# EAGLE design sonar (EAGLE 4.16)
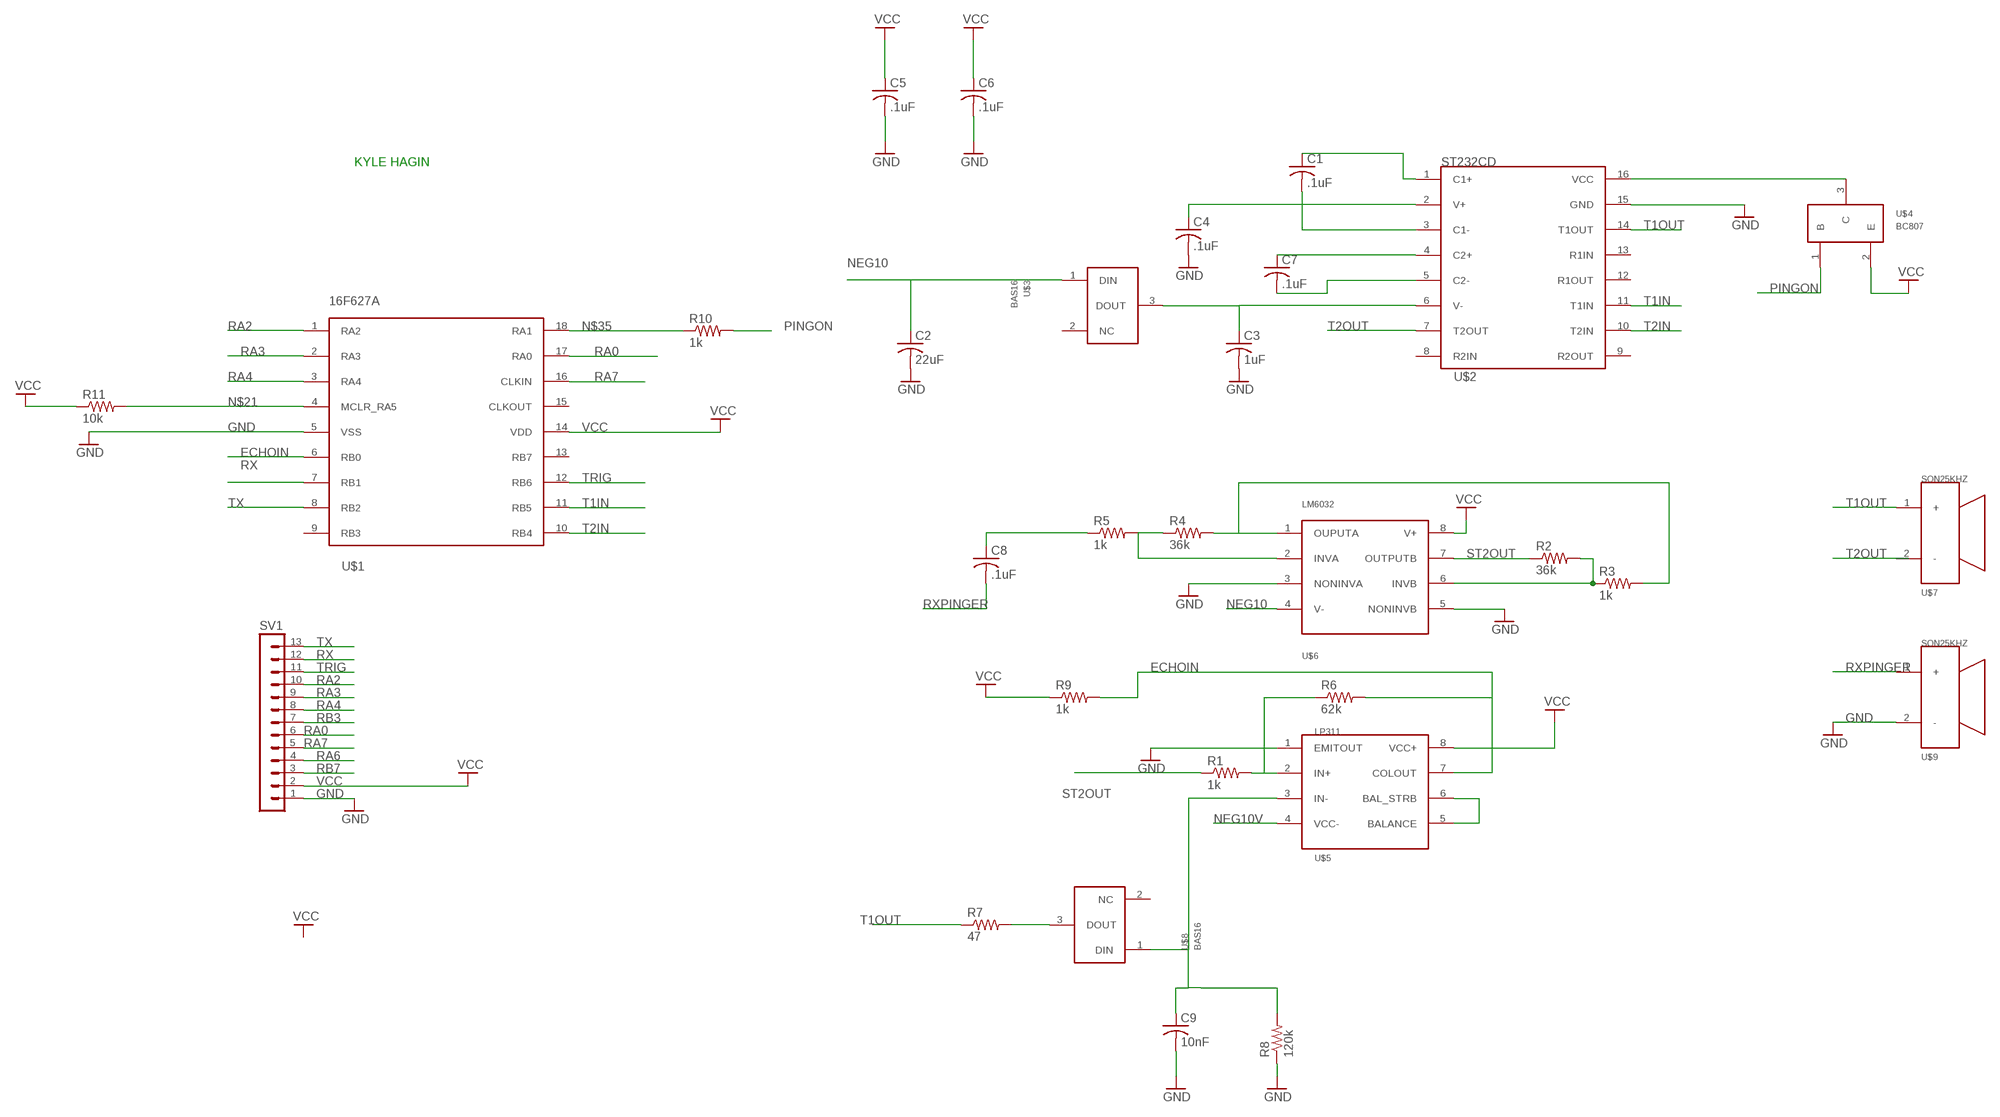
[diagram p0: schematic, sheet 1]

## Parts
C1  .1uF  C-USC1206  [C1206]
C2  22uF  C-USC1206  [C1206]
C3  1uF  C-USC1206  [C1206]
C4  .1uF  C-USC1206  [C1206]
C5  .1uF  C-USC1206  [C1206]
C6  .1uF  C-USC1206  [C1206]
C7  .1uF  C-USC1206  [C1206]
C8  .1uF  C-USC1206  [C1206]
C9  10nF  C-USC1206  [C1206]
R1  1k  R-US_R1206  [R1206]
R2  36k  R-US_R1206  [R1206]
R3  1k  R-US_R1206  [R1206]
R4  36k  R-US_R1206  [R1206]
R5  1k  R-US_R1206  [R1206]
R6  62k  R-US_R1206  [R1206]
R7  47  R-US_R1206  [R1206]
R8  120k  R-US_R1206  [R1206]
R9  1k  R-US_R1206  [R1206]
R10  1k  R-US_R1206  [R1206]
R11  10k  R-US_R1206  [R1206]
SV1  MA13-1W  [MA13-1W]
U$1  16F627A  [DIL18]
U$2  ST232CD  [SOIC-16]
U$3  BAS16  [SOT23]
U$4  BC807  [SOT23]
U$5  LP311  [SOIC8]
U$6  LM6032  [SOIC8]
U$7  SON25KHZ  [MPB1]
U$8  BAS16  [SOT23]
U$9  SON25KHZ  [MPB1]

## Nets
ECHOIN: R6.2 R9.2 U$1.6(RB0) U$5.7(COLOUT)
GND: C2.2 C3.2 C4.2 C5.2 C6.2 C9.2 R8.1 SV1.1 U$1.5(VSS) U$2.15(GND) U$5.1(EMITOUT) U$6.3(NONINVA) U$6.5(NONINVB) U$9.2(-)
N$1: C1.1 U$2.1(C1+)
N$2: C1.2 U$2.3(C1-)
N$3: C4.1 U$2.2(V+)
N$4: C7.1 U$2.4(C2+)
N$5: C7.2 U$2.5(C2-)
N$6: C3.1 U$2.6(V-) U$3.3(DOUT)
N$8: R3.2 R4.2 U$6.1(OUPUTA)
N$9: U$2.16(VCC) U$4.3(C)
N$10: R4.1 R5.2 U$6.2(INVA)
N$11: U$5.5(BALANCE) U$5.6(BAL_STRB)
N$12: R2.2 R3.1 U$6.6(INVB)
N$13: C8.1 R5.1
N$16: R1.2 R6.1 U$5.2(IN+)
N$17: R7.2 U$8.3(DOUT)
N$18: C9.1 R8.2 U$5.3(IN-) U$8.1(DIN)
N$21: R11.2 U$1.4(MCLR_RA5)
N$35: R10.1 U$1.18(RA1)
NEG10: C2.1 U$3.1(DIN) U$6.4(V-)
NEG10V: U$5.4(VCC-)
PINGON: R10.2 U$4.1(B)
RA0: SV1.6 U$1.17(RA0)
RA2: SV1.10 U$1.1(RA2)
RA3: SV1.9 U$1.2(RA3)
RA4: SV1.8 U$1.3(RA4)
RA6: SV1.4
RA7: SV1.5 U$1.16(CLKIN)
RB3: SV1.7
RB7: SV1.3
RX: SV1.12 U$1.7(RB1)
RXPINGER: C8.2 U$9.1(+)
ST2OUT: R1.1 R2.1 U$6.7(OUTPUTB)
T1IN: U$1.11(RB5) U$2.11(T1IN)
T1OUT: R7.1 U$2.14(T1OUT) U$7.1(+)
T2IN: U$1.10(RB4) U$2.10(T2IN)
T2OUT: U$2.7(T2OUT)
TRIG: SV1.11 U$1.12(RB6)
TX: SV1.13 U$1.8(RB2)
VCC: C5.1 C6.1 R9.1 R11.1 SV1.2 U$1.14(VDD) U$4.2(E) U$5.8(VCC+) U$6.8(V+)
Unconnected: U$1.9(RB3) U$1.13(RB7) U$1.15(CLKOUT) U$2.8(R2IN) U$2.9(R2OUT) U$2.12(R1OUT) U$2.13(R1IN) U$3.2(NC) U$7.2(-) U$8.2(NC)

## Notes on the sheet
- KYLE HAGIN

## Library data of the parts
C1-C9 = rcl:C-US: CAPACITOR, American symbol
R1-R11 = rcl:R-US_: RESISTOR, American symbol
SV1 = con-lstb:MA13-1W: PIN HEADER
U$1 = microchip:16F627A
U$2 = TXCVR:ST232CD
U$3 U$8 = TXCVR:BAS16
U$4 = TXCVR:BC807
U$5 = TXCVR:LP311
U$6 = TXCVR:LM6032
U$7 U$9 = con-hirschmann:SON25KHZ

## Board
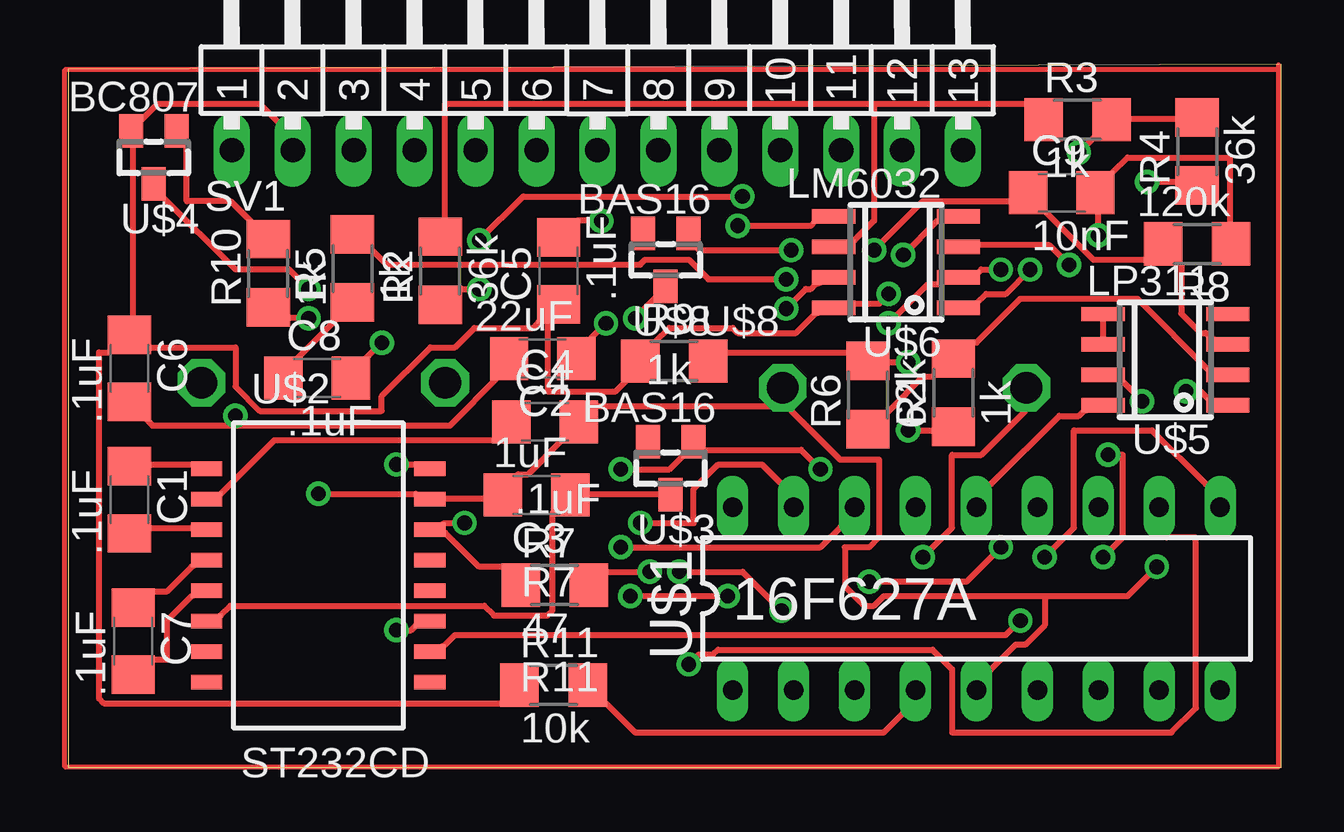
[diagram p1: board, top side]
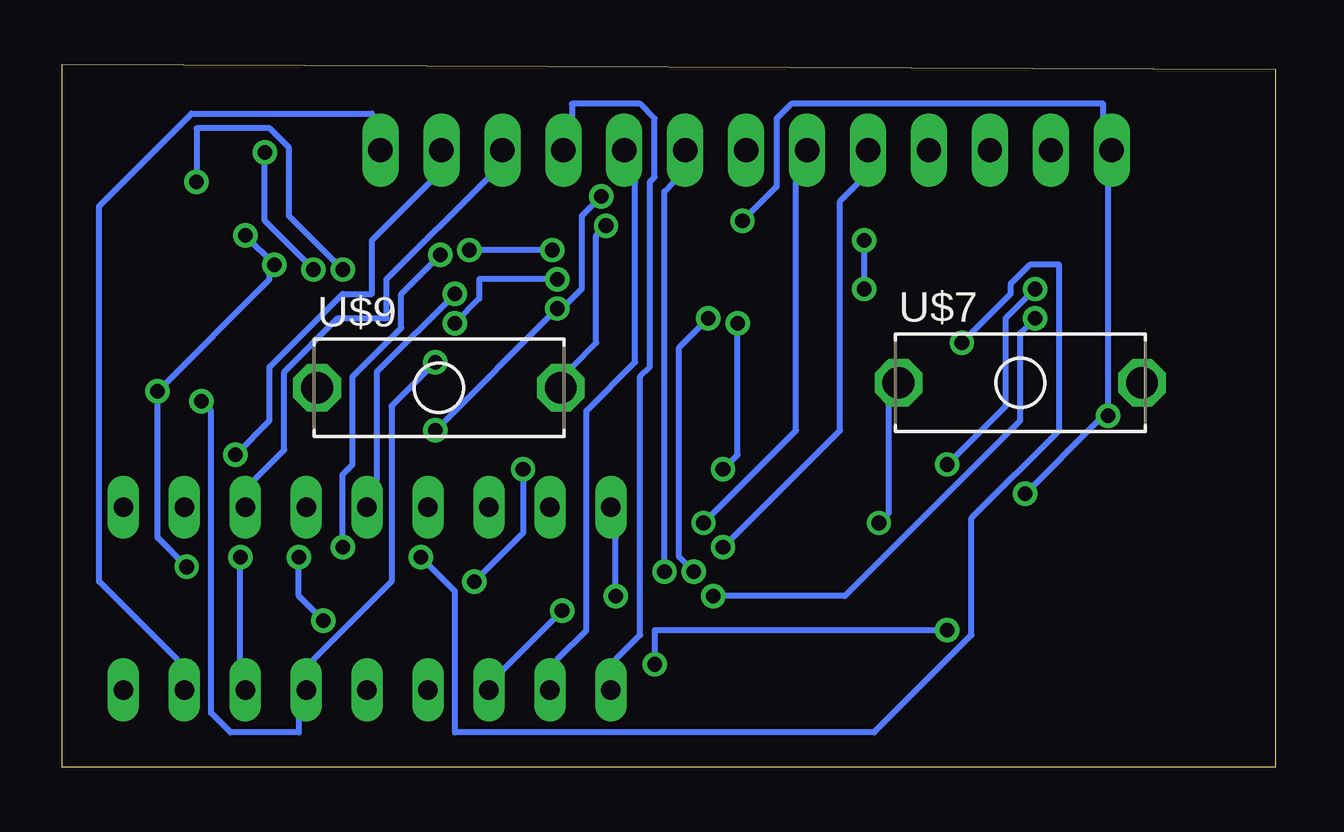
[diagram p2: board, bottom side, seen from below]

Size 50.57 x 29.3 mm. Coordinates in mm from the lower left corner, seen from the top.
Outline: 0,0 50.57,0 50.57,29.3 0,29.1 0,0
Copper layers (1*16): Top 0.035mm / dielectric 1.5mm / Bottom 0.035mm
Design rules "default": minimum track width 10mil, minimum drill 24mil, track to track 8mil, track to pad 8mil, pad to pad 8mil, via to via 8mil, smd to smd 8mil, copper to edge 40mil, drill to drill 8mil, minimum pad ring 10mil, minimum via ring 8mil, stop-mask expansion 4mil, vias tented up to drill 0mil, thermal gap 10mil

### Footprints (pad centres in the part's own frame; a part is rotated, then mirrored left to right if it is on the bottom)
C1206 = smd 1.6 x 1.8: 1 -1.4,0; 2 1.4,0
R1206 = smd 1.6 x 1.803: 1 -1.422,0; 2 1.422,0
MA13-1W = drill 1.016 long: 1 -15.24,0; 2 -12.7,0; 3 -10.16,0; 4 -7.62,0; 5 -5.08,0; 6 -2.54,0; 7 0,0; 8 2.54,0; 9 5.08,0; 10 7.62,0; 11 10.16,0; 12 12.7,0; 13 15.24,0
DIL18 = drill 0.813 long: 1 -10.16,-3.81; 2 -7.62,-3.81; 3 -5.08,-3.81; 4 -2.54,-3.81; 5 0,-3.81; 6 2.54,-3.81; 7 5.08,-3.81; 8 7.62,-3.81; 9 10.16,-3.81; 10 10.16,3.81; 11 7.62,3.81; 12 5.08,3.81; 13 2.54,3.81; 14 0,3.81; 15 -2.54,3.81; 16 -5.08,3.81; 17 -7.62,3.81; 18 -10.16,3.81
SOIC-16 = smd 0.6 x 1.3: 1 -4.445,-4.65; 2 -3.175,-4.65; 3 -1.905,-4.65; 4 -0.635,-4.65; 5 0.635,-4.65; 6 1.905,-4.65; 7 3.175,-4.65; 8 4.445,-4.65; 9 4.445,4.65; 10 3.175,4.65; 11 1.905,4.65; 12 0.635,4.65; 13 -0.635,4.65; 14 -1.905,4.65; 15 -3.175,4.65; 16 -4.445,4.65
SOT23 = smd 1 x 1.4: 1 -0.95,-1.1; 2 0.95,-1.1; 3 0,1.1
SOIC8 = smd 0.6 x 1.8: 1 -1.905,-2.6; 2 -0.635,-2.6; 3 0.635,-2.6; 4 1.905,-2.6; 5 1.905,2.6; 6 0.635,2.6; 7 -0.635,2.6; 8 -1.905,2.6
MPB1 = drill 1.321 octagon: 1 -5.08,0; 2 5.08,0

### Placement (x,y rotation side)
C1  2.55,11.15 270 top
C2  19.77,17.04 180 top
C3  19.52,11.35 180 top
C4  19.88,14.4 0 top
C5  20.43,20.7 90 top
C6  2.55,16.63 270 top
C7  2.71,5.25 270 top
C8  10.38,16.23 0 top
C9  41.41,23.95 0 top
R1  36.89,15.62 90 top
R2  15.51,20.7 90 top
R3  42.08,27 0 top
R4  47.05,25.67 90 top
R5  11.85,20.8 90 top
R6  33.34,15.51 90 top
R7  20.28,7.59 0 top
R8  47.05,21.81 180 top
R9  25.26,16.94 0 top
R10  8.34,20.59 90 top
R11  20.23,3.42 0 top
SV1  22.06,25.73 0 top
U$1  37.86,7.03 0 top
U$2  10.43,8 270 top
U$3  25.11,12.47 180 top
U$4  3.57,25.42 180 top
U$5  45.73,16.99 90 top
U$6  34.51,21.05 90 top
U$7  10.63,16.02 0 bottom
U$8  24.9,21.15 180 top
U$9  34.86,15.82 0 bottom

### Tracks (layer width: path | path; a pad name or v marks a point on that pad's centre or on a via)
ECHOIN  (via drill 0.61)
  Top 0.254: R9.2 27.29,17.29 32.58,17.29 R6.2 34.2,16.89 v35.01,16.89 | v44.77,15.26 43.96,16.07 U$5.7
  Bottom 0.254: v44.77,15.26 44.36,14.85 44.36,2.26 43.55,1.44 40.7,1.44 40.7,2.05 U$1.6 40.09,4.49 36.84,7.74 36.84,15.06 v35.01,16.89
GND  (via drill 0.61)
  Top 0.254: 6.97,14.24 15.91,14.24 17.95,16.28 C2.2 | 6.97,14.24 3.52,14.24 3.32,14.45 C6.2 | v22.21,22.78 21.2,22.78 C5.2 | 6.97,14.24 v6.97,14.65 | v41.72,20.95 40.91,21.76 37.86,21.76 U$6.3 | v42.94,22.17 42.94,23.19 C9.2 43.55,24.81 44.16,25.42 48.43,25.42 48.43,22.58 R8.1 | v46.6,15.67 47.21,15.67 47.61,15.26 U$5.1 | v27.9,22.58 30.95,22.58 31.15,22.78 U$6.5 | 40.7,7.13 40.7,5.91 39.89,5.1 39.48,5.1 38.47,4.08 U$1.5 | 40.7,7.13 34,7.13 33.59,6.73 33.19,6.73 32.37,7.54 32.37,9.16 33.39,9.16 33.8,9.57 33.8,12.82 32.17,12.82 30.14,14.85 U$9.2 29.32,15.06 22.01,15.06 C4.2 20.59,13.63 19.16,12.21 18.76,12.21 C3.2 17.34,11.2 15.71,11.2 U$2.15 14.49,11.4 v10.43,11.4 | v45.38,8.35 44.16,7.13 40.7,7.13
  Bottom 0.254: v22.21,22.78 20.79,24.2 20.79,27.05 20.18,27.66 7.18,27.66 7.18,27.05 SV1.1 6.97,24.4 v6.97,14.65 7.38,14.45 v10.43,11.4 | v42.94,22.17 v41.72,20.95 41.92,20.54 41.92,20.34 v46.6,15.67 46.6,9.57 v45.38,8.35 | v27.9,22.58 28.31,22.17 28.31,17.7 29.32,16.68 U$9.2
N$1
  Top 0.254: U$2.1 5.14,12.62 3.32,12.62 C1.1
N$2
  Top 0.254: U$2.3 5.14,9.98 3.32,9.98 C1.2
N$3
  Top 0.254: U$2.2 6.36,11.4 8.6,13.63 17.74,13.63 C4.1
N$4
  Top 0.254: U$2.4 5.14,8.35 4.13,7.34 3.52,7.34 C7.1
N$5
  Top 0.254: U$2.5 5.14,7.13 4.13,6.12 4.13,4.49 3.52,4.49 C7.2
N$6
  Top 0.254: U$2.6 6.36,6.32 6.77,6.73 17.34,6.73 17.74,6.32 19.98,6.32 20.18,6.52 20.18,10.59 C3.1 21.6,11.4 24.65,11.4 U$3.3
N$7
  Top 0.203: 50.46,29.08 50.46,0.02 -0.14,0.02 -0.14,29.08 50.46,29.08 | 50.46,29.08 50.46,29.28
N$8  (via drill 0.61)
  Top 0.254: v40.09,20.75 39.08,19.73 38.27,19.73 37.86,19.32 U$6.1 | v42.13,25.62 42.74,26.23 R3.2 44.16,27.05 46.19,27.05 R4.2
  Bottom 0.254: v40.09,20.75 42.13,22.78 v42.13,25.62
N$9  (via drill 0.61)
  Top 0.254: v13.68,12.62 14.49,12.62 U$2.16 | v10.02,19.93 9.21,20.75 6.97,20.75 3.92,23.79 U$4.3
  Bottom 0.254: v13.68,12.62 11.24,15.06 11.24,18.71 v10.02,19.93
N$10  (via drill 0.61)
  Top 0.254: v38.88,20.75 38.06,20.75 37.86,20.54 U$6.2 36.23,20.14 35.83,20.14 v34.2,18.51 | v44.97,24.4 46.19,24.4 R4.1 | v29.93,20.34 26.68,20.34 25.87,21.15 24.04,21.15 23.84,20.95 13.27,20.95 12.66,21.56 R5.2
  Bottom 0.254: v38.88,20.75 41.11,22.98 41.11,25.83 41.92,26.64 44.97,26.64 v44.97,24.4 | v29.93,20.34 33.19,20.34 33.19,19.53 v34.2,18.51
N$11
  Top 0.254: U$5.6 43.14,17.9 43.14,18.71 U$5.5
N$12
  Top 0.254: 33.59,27.66 33.59,22.78 32.78,21.97 U$6.6 | 33.59,27.66 39.89,27.66 R3.1 | 33.59,27.66 15.71,27.66 15.71,22.78 R2.2
N$13
  Top 0.254: C8.1 9.61,17.09 11.24,18.71 R5.1
N$16
  Top 0.254: U$5.2 47.61,16.48 44.56,19.53 39.69,19.53 37.86,17.7 37.66,17.7 R1.2 36.03,16.28 35.62,16.28 34.2,14.85 R6.1
N$17  (via drill 0.61)
  Top 0.254: v23.64,18.71 24.45,19.53 U$8.3 | v24.24,8.15 22.42,8.15 R7.2
  Bottom 0.254: v23.64,18.71 24.85,17.5 24.85,8.76 v24.24,8.15
N$18  (via drill 0.61)
  Top 0.254: U$5.3 47.61,17.9 47.41,18.11 47.21,18.11 46.39,18.92 46.39,20.95 R8.2 44.97,21.15 42.74,21.15 40.7,23.19 C9.1 39.28,23.59 35.62,23.59 v33.59,21.56 | v30.14,21.56 26.28,21.56 U$8.1
  Bottom 0.254: v30.14,21.56 v33.59,21.56
N$21
  Top 0.254: R11.2 22.42,2.66 23.64,1.44 34,1.44 34.81,2.26 U$1.4
N$35  (via drill 0.61)
  Top 0.254: v10.02,18.71 9.21,18.71 R10.1 | v23.43,7.13 v27.5,7.13
  Bottom 0.254: v10.02,18.71 10.63,18.11 10.63,14.45 17.95,7.13 v23.43,7.13 | v27.5,7.13 27.5,9.57 U$1.18
NEG10  (via drill 0.61)
  Top 0.254: v23.03,12.42 25.06,12.42 25.67,13.03 U$3.1 26.48,13.23 30.54,13.23 v31.36,12.42 | v22.42,18.51 21.81,17.9 C2.1 | v34.81,21.36 36.23,22.78 U$6.4 | v38.88,9.16 37.45,7.74 v33.39,7.74
  Bottom 0.254: v23.03,12.42 22.42,13.03 v22.42,18.51 | v34.81,21.36 36.44,19.73 36.44,18.31 38.47,16.28 38.47,12.62 38.88,12.21 v38.88,9.16 | v33.39,7.74 31.36,9.77 v31.36,12.42
PINGON
  Top 0.254: U$4.1 4.94,25.83 4.94,23.59 6.77,23.59 7.58,22.78 R10.2
RA0  (via drill 0.61)
  Top 0.254: v23.84,10.18 26.07,10.18 26.07,11.6 27.09,12.62 28.92,12.62 29.73,11.81 U$1.17
  Bottom 0.254: v23.84,10.18 19.98,14.04 19.98,24.4 SV1.6
RA2
  Bottom 0.254: U$1.1 27.5,4.49 26.48,5.51 26.48,16.28 26.07,16.68 26.07,24.4 25.87,24.61 25.87,27.05 26.48,27.66 29.32,27.66 29.32,27.05 SV1.10
RA3
  Bottom 0.254: U$1.2 29.93,4.49 28.72,5.71 28.72,14.85 26.68,16.89 26.68,24.4 SV1.9
RA4  (via drill 0.61)
  Top 0.254: v29.73,6.52 28.11,8.15 v25.46,8.15
  Bottom 0.254: v29.73,6.52 32.17,4.08 U$1.3 | v25.46,8.15 25.46,24 25.06,24.4 SV1.8
RA7  (via drill 0.61)
  Top 0.254: v23.03,9.16 31.36,9.16 32.17,9.98 U$1.16
  Bottom 0.254: v23.03,9.16 18.15,14.04 18.15,23.59 17.34,24.4 SV1.5
RX  (via drill 0.61)
  Top 0.254: v43.14,8.76 43.96,9.57 43.96,13.03 v43.35,13.03
  Bottom 0.254: v43.14,8.76 43.14,4.49 U$1.7 | v43.35,13.03 41.92,14.45 41.92,16.68 38.88,19.73 37.66,19.73 37.66,21.97 35.22,24.4 SV1.12
RXPINGER  (via drill 0.61)
  Top 0.254: v13.07,17.7 12.46,17.09 C8.2 | v35.62,8.76 36.84,9.98 36.84,13.03 38.06,13.03 39.89,14.85 U$9.1
  Bottom 0.254: v13.07,17.7 11.04,19.73 11.04,20.14 10.22,20.95 9,20.95 9,14.04 12.66,10.38 12.66,5.51 16.73,1.44 34.2,1.44 34.2,7.34 v35.62,8.76
ST2OUT  (via drill 0.61)
  Top 0.254: v29.93,19.12 30.75,19.93 30.95,19.93 31.15,20.14 U$6.7 | v35.01,14.04 36.03,14.04 R1.1 | v17.13,19.93 16.32,19.93 R2.1 | v17.13,21.97 18.96,23.79 v28.11,23.79
  Bottom 0.254: v35.01,14.04 v29.93,19.12 29.53,19.32 28.92,19.93 28.92,22.98 v28.11,23.79 | v17.13,19.93 v17.13,21.97
T1IN  (via drill 0.61)
  Top 0.254: v13.68,5.71 14.29,5.71 14.49,5.91 U$2.11 | v25.87,4.29 26.28,4.69 26.89,4.69 27.09,4.9 36.03,4.9 36.84,4.08 36.84,1.44 45.99,1.44 47,2.46 47,9.57 45.78,9.57 U$1.11
  Bottom 0.254: v13.68,5.71 25.87,5.71 v25.87,4.29
T1OUT  (via drill 0.61)
  Top 0.254: R7.1 18.15,8.35 17.13,8.35 15.71,9.77 U$2.14 15.71,10.18 v16.52,10.18
  Bottom 0.254: v16.52,10.18 16.12,10.59 16.12,15.06 U$7.1
T2IN  (via drill 0.61)
  Top 0.254: v39.69,6.12 39.08,5.51 16.12,5.51 15.71,5.1 U$2.10 | v40.7,8.76 41.92,9.98 41.92,14.04 45.17,14.04 47.41,11.81 U$1.10
  Bottom 0.254: v39.69,6.12 40.7,7.13 v40.7,8.76
TRIG
  Bottom 0.254: U$1.12 42.53,12.01 41.31,13.23 41.31,16.48 39.08,18.71 37.05,18.71 37.05,20.34 32.78,24.61 SV1.11
TX
  Bottom 0.254: U$1.8 45.78,4.49 49.04,7.74 49.04,23.39 45.17,27.25 37.66,27.25 37.66,27.05 SV1.13
VCC  (via drill 0.61)
  Top 0.254: U$5.8 42.33,14.85 42.13,14.65 41.31,14.65 38.47,11.81 U$1.14 | v34.2,19.73 33.8,19.32 32.78,19.32 U$6.8 31.15,18.92 30.34,18.11 27.9,18.11 27.7,18.31 25.06,18.31 24.45,17.7 R9.1 23.23,16.07 22.82,15.67 19.98,15.67 19.98,18.51 C5.1 19.57,18.51 19.37,18.31 16.93,18.31 16.12,17.5 15.1,17.5 13.07,15.46 13.07,14.85 7.99,14.85 6.97,15.87 6.97,17.5 3.32,17.5 C6.1 | C6.1 2.71,18.71 2.71,25.83 U$4.2 3.11,27.05 3.72,27.66 7.99,27.66 8.8,26.84 SV1.2 | R11.1 18.15,2.66 1.49,2.66 1.28,2.87 1.28,17.29 1.69,17.29 C6.1
  Bottom 0.254: v34.2,19.73 37.45,16.48 37.45,12.01 U$1.14

### Text on the board
_tsilk: BC807 | 1 | 2 | 3 | 4 | 5 | 6 | 7 | 8 | 9 | 10 | 11 | 12 | 13 | R3 | LM6032 | C9 | 1k | BAS16 | R4 | 120k | 36k | U$4 | SV1 | 10nF | LP311 | R8 | R10 | R5 | 1k | 1k | R2 | 36k | C5 | 22uF | .1uF | U$8 | .1uF | C6 | R9 | U$6 | C8 | C4 | C2 | 1k | BAS16 | U$2 | .1uF | 1uF | R6 | 62k | R1 | 1k | U$5 | .1uF | C1 | .1uF | C3 | U$3 | R7 | .1uF | C7 | 16F627A | 47 | U$1 | R11 | 10k | ST232CD
_bsilk: U$7 | U$9 | SON25KHZ | SON25KHZ